# Altium project LED_Matrix.PrjPcb (part 3 of 3)

## Sheet LED.SchDoc
size A3; SheetNumber: 6; SheetTotal: 6
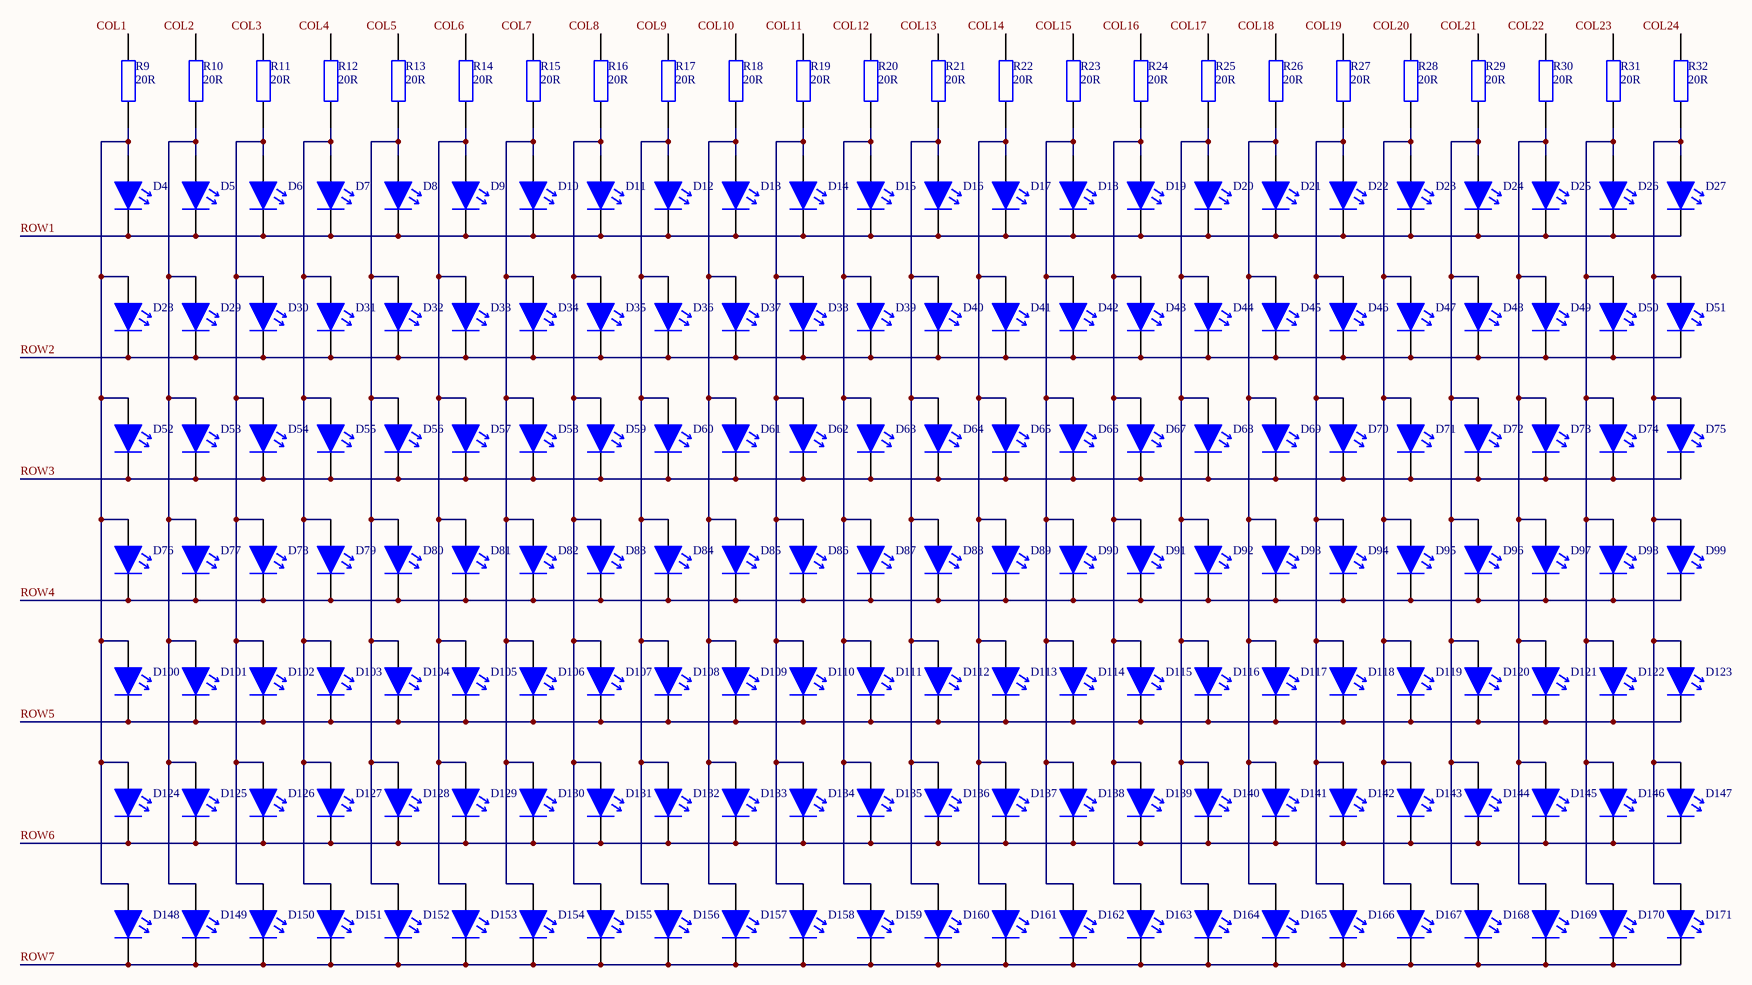
[diagram p5: LED.SchDoc]

### Parts
D4  EAHE2835WD63  [LED_WHITE_1411_PLCC2]  (value not drawn)
D5  EAHE2835WD63  [LED_WHITE_1411_PLCC2]  (value not drawn)
D6  EAHE2835WD63  [LED_WHITE_1411_PLCC2]  (value not drawn)
D7  EAHE2835WD63  [LED_WHITE_1411_PLCC2]  (value not drawn)
D8  EAHE2835WD63  [LED_WHITE_1411_PLCC2]  (value not drawn)
D9  EAHE2835WD63  [LED_WHITE_1411_PLCC2]  (value not drawn)
D10  EAHE2835WD63  [LED_WHITE_1411_PLCC2]  (value not drawn)
D11  EAHE2835WD63  [LED_WHITE_1411_PLCC2]  (value not drawn)
D12  EAHE2835WD63  [LED_WHITE_1411_PLCC2]  (value not drawn)
D13  EAHE2835WD63  [LED_WHITE_1411_PLCC2]  (value not drawn)
D14  EAHE2835WD63  [LED_WHITE_1411_PLCC2]  (value not drawn)
D15  EAHE2835WD63  [LED_WHITE_1411_PLCC2]  (value not drawn)
D16  EAHE2835WD63  [LED_WHITE_1411_PLCC2]  (value not drawn)
D17  EAHE2835WD63  [LED_WHITE_1411_PLCC2]  (value not drawn)
D18  EAHE2835WD63  [LED_WHITE_1411_PLCC2]  (value not drawn)
D19  EAHE2835WD63  [LED_WHITE_1411_PLCC2]  (value not drawn)
D20  EAHE2835WD63  [LED_WHITE_1411_PLCC2]  (value not drawn)
D21  EAHE2835WD63  [LED_WHITE_1411_PLCC2]  (value not drawn)
D22  EAHE2835WD63  [LED_WHITE_1411_PLCC2]  (value not drawn)
D23  EAHE2835WD63  [LED_WHITE_1411_PLCC2]  (value not drawn)
D24  EAHE2835WD63  [LED_WHITE_1411_PLCC2]  (value not drawn)
D25  EAHE2835WD63  [LED_WHITE_1411_PLCC2]  (value not drawn)
D26  EAHE2835WD63  [LED_WHITE_1411_PLCC2]  (value not drawn)
D27  EAHE2835WD63  [LED_WHITE_1411_PLCC2]  (value not drawn)
D28  EAHE2835WD63  [LED_WHITE_1411_PLCC2]  (value not drawn)
D29  EAHE2835WD63  [LED_WHITE_1411_PLCC2]  (value not drawn)
D30  EAHE2835WD63  [LED_WHITE_1411_PLCC2]  (value not drawn)
D31  EAHE2835WD63  [LED_WHITE_1411_PLCC2]  (value not drawn)
D32  EAHE2835WD63  [LED_WHITE_1411_PLCC2]  (value not drawn)
D33  EAHE2835WD63  [LED_WHITE_1411_PLCC2]  (value not drawn)
D34  EAHE2835WD63  [LED_WHITE_1411_PLCC2]  (value not drawn)
D35  EAHE2835WD63  [LED_WHITE_1411_PLCC2]  (value not drawn)
D36  EAHE2835WD63  [LED_WHITE_1411_PLCC2]  (value not drawn)
D37  EAHE2835WD63  [LED_WHITE_1411_PLCC2]  (value not drawn)
D38  EAHE2835WD63  [LED_WHITE_1411_PLCC2]  (value not drawn)
D39  EAHE2835WD63  [LED_WHITE_1411_PLCC2]  (value not drawn)
D40  EAHE2835WD63  [LED_WHITE_1411_PLCC2]  (value not drawn)
D41  EAHE2835WD63  [LED_WHITE_1411_PLCC2]  (value not drawn)
D42  EAHE2835WD63  [LED_WHITE_1411_PLCC2]  (value not drawn)
D43  EAHE2835WD63  [LED_WHITE_1411_PLCC2]  (value not drawn)
D44  EAHE2835WD63  [LED_WHITE_1411_PLCC2]  (value not drawn)
D45  EAHE2835WD63  [LED_WHITE_1411_PLCC2]  (value not drawn)
D46  EAHE2835WD63  [LED_WHITE_1411_PLCC2]  (value not drawn)
D47  EAHE2835WD63  [LED_WHITE_1411_PLCC2]  (value not drawn)
D48  EAHE2835WD63  [LED_WHITE_1411_PLCC2]  (value not drawn)
D49  EAHE2835WD63  [LED_WHITE_1411_PLCC2]  (value not drawn)
D50  EAHE2835WD63  [LED_WHITE_1411_PLCC2]  (value not drawn)
D51  EAHE2835WD63  [LED_WHITE_1411_PLCC2]  (value not drawn)
D52  EAHE2835WD63  [LED_WHITE_1411_PLCC2]  (value not drawn)
D53  EAHE2835WD63  [LED_WHITE_1411_PLCC2]  (value not drawn)
D54  EAHE2835WD63  [LED_WHITE_1411_PLCC2]  (value not drawn)
D55  EAHE2835WD63  [LED_WHITE_1411_PLCC2]  (value not drawn)
D56  EAHE2835WD63  [LED_WHITE_1411_PLCC2]  (value not drawn)
D57  EAHE2835WD63  [LED_WHITE_1411_PLCC2]  (value not drawn)
D58  EAHE2835WD63  [LED_WHITE_1411_PLCC2]  (value not drawn)
D59  EAHE2835WD63  [LED_WHITE_1411_PLCC2]  (value not drawn)
D60  EAHE2835WD63  [LED_WHITE_1411_PLCC2]  (value not drawn)
D61  EAHE2835WD63  [LED_WHITE_1411_PLCC2]  (value not drawn)
D62  EAHE2835WD63  [LED_WHITE_1411_PLCC2]  (value not drawn)
D63  EAHE2835WD63  [LED_WHITE_1411_PLCC2]  (value not drawn)
D64  EAHE2835WD63  [LED_WHITE_1411_PLCC2]  (value not drawn)
D65  EAHE2835WD63  [LED_WHITE_1411_PLCC2]  (value not drawn)
D66  EAHE2835WD63  [LED_WHITE_1411_PLCC2]  (value not drawn)
D67  EAHE2835WD63  [LED_WHITE_1411_PLCC2]  (value not drawn)
D68  EAHE2835WD63  [LED_WHITE_1411_PLCC2]  (value not drawn)
D69  EAHE2835WD63  [LED_WHITE_1411_PLCC2]  (value not drawn)
D70  EAHE2835WD63  [LED_WHITE_1411_PLCC2]  (value not drawn)
D71  EAHE2835WD63  [LED_WHITE_1411_PLCC2]  (value not drawn)
D72  EAHE2835WD63  [LED_WHITE_1411_PLCC2]  (value not drawn)
D73  EAHE2835WD63  [LED_WHITE_1411_PLCC2]  (value not drawn)
D74  EAHE2835WD63  [LED_WHITE_1411_PLCC2]  (value not drawn)
D75  EAHE2835WD63  [LED_WHITE_1411_PLCC2]  (value not drawn)
D76  EAHE2835WD63  [LED_WHITE_1411_PLCC2]  (value not drawn)
D77  EAHE2835WD63  [LED_WHITE_1411_PLCC2]  (value not drawn)
D78  EAHE2835WD63  [LED_WHITE_1411_PLCC2]  (value not drawn)
D79  EAHE2835WD63  [LED_WHITE_1411_PLCC2]  (value not drawn)
D80  EAHE2835WD63  [LED_WHITE_1411_PLCC2]  (value not drawn)
D81  EAHE2835WD63  [LED_WHITE_1411_PLCC2]  (value not drawn)
D82  EAHE2835WD63  [LED_WHITE_1411_PLCC2]  (value not drawn)
D83  EAHE2835WD63  [LED_WHITE_1411_PLCC2]  (value not drawn)
D84  EAHE2835WD63  [LED_WHITE_1411_PLCC2]  (value not drawn)
D85  EAHE2835WD63  [LED_WHITE_1411_PLCC2]  (value not drawn)
D86  EAHE2835WD63  [LED_WHITE_1411_PLCC2]  (value not drawn)
D87  EAHE2835WD63  [LED_WHITE_1411_PLCC2]  (value not drawn)
D88  EAHE2835WD63  [LED_WHITE_1411_PLCC2]  (value not drawn)
D89  EAHE2835WD63  [LED_WHITE_1411_PLCC2]  (value not drawn)
D90  EAHE2835WD63  [LED_WHITE_1411_PLCC2]  (value not drawn)
D91  EAHE2835WD63  [LED_WHITE_1411_PLCC2]  (value not drawn)
D92  EAHE2835WD63  [LED_WHITE_1411_PLCC2]  (value not drawn)
D93  EAHE2835WD63  [LED_WHITE_1411_PLCC2]  (value not drawn)
D94  EAHE2835WD63  [LED_WHITE_1411_PLCC2]  (value not drawn)
D95  EAHE2835WD63  [LED_WHITE_1411_PLCC2]  (value not drawn)
D96  EAHE2835WD63  [LED_WHITE_1411_PLCC2]  (value not drawn)
D97  EAHE2835WD63  [LED_WHITE_1411_PLCC2]  (value not drawn)
D98  EAHE2835WD63  [LED_WHITE_1411_PLCC2]  (value not drawn)
D99  EAHE2835WD63  [LED_WHITE_1411_PLCC2]  (value not drawn)
D100  EAHE2835WD63  [LED_WHITE_1411_PLCC2]  (value not drawn)
D101  EAHE2835WD63  [LED_WHITE_1411_PLCC2]  (value not drawn)
D102  EAHE2835WD63  [LED_WHITE_1411_PLCC2]  (value not drawn)
D103  EAHE2835WD63  [LED_WHITE_1411_PLCC2]  (value not drawn)
D104  EAHE2835WD63  [LED_WHITE_1411_PLCC2]  (value not drawn)
D105  EAHE2835WD63  [LED_WHITE_1411_PLCC2]  (value not drawn)
D106  EAHE2835WD63  [LED_WHITE_1411_PLCC2]  (value not drawn)
D107  EAHE2835WD63  [LED_WHITE_1411_PLCC2]  (value not drawn)
D108  EAHE2835WD63  [LED_WHITE_1411_PLCC2]  (value not drawn)
D109  EAHE2835WD63  [LED_WHITE_1411_PLCC2]  (value not drawn)
D110  EAHE2835WD63  [LED_WHITE_1411_PLCC2]  (value not drawn)
D111  EAHE2835WD63  [LED_WHITE_1411_PLCC2]  (value not drawn)
D112  EAHE2835WD63  [LED_WHITE_1411_PLCC2]  (value not drawn)
D113  EAHE2835WD63  [LED_WHITE_1411_PLCC2]  (value not drawn)
D114  EAHE2835WD63  [LED_WHITE_1411_PLCC2]  (value not drawn)
D115  EAHE2835WD63  [LED_WHITE_1411_PLCC2]  (value not drawn)
D116  EAHE2835WD63  [LED_WHITE_1411_PLCC2]  (value not drawn)
D117  EAHE2835WD63  [LED_WHITE_1411_PLCC2]  (value not drawn)
D118  EAHE2835WD63  [LED_WHITE_1411_PLCC2]  (value not drawn)
D119  EAHE2835WD63  [LED_WHITE_1411_PLCC2]  (value not drawn)
D120  EAHE2835WD63  [LED_WHITE_1411_PLCC2]  (value not drawn)
D121  EAHE2835WD63  [LED_WHITE_1411_PLCC2]  (value not drawn)
D122  EAHE2835WD63  [LED_WHITE_1411_PLCC2]  (value not drawn)
D123  EAHE2835WD63  [LED_WHITE_1411_PLCC2]  (value not drawn)
D124  EAHE2835WD63  [LED_WHITE_1411_PLCC2]  (value not drawn)
D125  EAHE2835WD63  [LED_WHITE_1411_PLCC2]  (value not drawn)
D126  EAHE2835WD63  [LED_WHITE_1411_PLCC2]  (value not drawn)
D127  EAHE2835WD63  [LED_WHITE_1411_PLCC2]  (value not drawn)
D128  EAHE2835WD63  [LED_WHITE_1411_PLCC2]  (value not drawn)
D129  EAHE2835WD63  [LED_WHITE_1411_PLCC2]  (value not drawn)
D130  EAHE2835WD63  [LED_WHITE_1411_PLCC2]  (value not drawn)
D131  EAHE2835WD63  [LED_WHITE_1411_PLCC2]  (value not drawn)
D132  EAHE2835WD63  [LED_WHITE_1411_PLCC2]  (value not drawn)
D133  EAHE2835WD63  [LED_WHITE_1411_PLCC2]  (value not drawn)
D134  EAHE2835WD63  [LED_WHITE_1411_PLCC2]  (value not drawn)
D135  EAHE2835WD63  [LED_WHITE_1411_PLCC2]  (value not drawn)
D136  EAHE2835WD63  [LED_WHITE_1411_PLCC2]  (value not drawn)
D137  EAHE2835WD63  [LED_WHITE_1411_PLCC2]  (value not drawn)
D138  EAHE2835WD63  [LED_WHITE_1411_PLCC2]  (value not drawn)
D139  EAHE2835WD63  [LED_WHITE_1411_PLCC2]  (value not drawn)
D140  EAHE2835WD63  [LED_WHITE_1411_PLCC2]  (value not drawn)
D141  EAHE2835WD63  [LED_WHITE_1411_PLCC2]  (value not drawn)
D142  EAHE2835WD63  [LED_WHITE_1411_PLCC2]  (value not drawn)
D143  EAHE2835WD63  [LED_WHITE_1411_PLCC2]  (value not drawn)
D144  EAHE2835WD63  [LED_WHITE_1411_PLCC2]  (value not drawn)
D145  EAHE2835WD63  [LED_WHITE_1411_PLCC2]  (value not drawn)
D146  EAHE2835WD63  [LED_WHITE_1411_PLCC2]  (value not drawn)
D147  EAHE2835WD63  [LED_WHITE_1411_PLCC2]  (value not drawn)
D148  EAHE2835WD63  [LED_WHITE_1411_PLCC2]  (value not drawn)
D149  EAHE2835WD63  [LED_WHITE_1411_PLCC2]  (value not drawn)
D150  EAHE2835WD63  [LED_WHITE_1411_PLCC2]  (value not drawn)
D151  EAHE2835WD63  [LED_WHITE_1411_PLCC2]  (value not drawn)
D152  EAHE2835WD63  [LED_WHITE_1411_PLCC2]  (value not drawn)
D153  EAHE2835WD63  [LED_WHITE_1411_PLCC2]  (value not drawn)
D154  EAHE2835WD63  [LED_WHITE_1411_PLCC2]  (value not drawn)
D155  EAHE2835WD63  [LED_WHITE_1411_PLCC2]  (value not drawn)
D156  EAHE2835WD63  [LED_WHITE_1411_PLCC2]  (value not drawn)
D157  EAHE2835WD63  [LED_WHITE_1411_PLCC2]  (value not drawn)
D158  EAHE2835WD63  [LED_WHITE_1411_PLCC2]  (value not drawn)
D159  EAHE2835WD63  [LED_WHITE_1411_PLCC2]  (value not drawn)
D160  EAHE2835WD63  [LED_WHITE_1411_PLCC2]  (value not drawn)
D161  EAHE2835WD63  [LED_WHITE_1411_PLCC2]  (value not drawn)
D162  EAHE2835WD63  [LED_WHITE_1411_PLCC2]  (value not drawn)
D163  EAHE2835WD63  [LED_WHITE_1411_PLCC2]  (value not drawn)
D164  EAHE2835WD63  [LED_WHITE_1411_PLCC2]  (value not drawn)
D165  EAHE2835WD63  [LED_WHITE_1411_PLCC2]  (value not drawn)
D166  EAHE2835WD63  [LED_WHITE_1411_PLCC2]  (value not drawn)
D167  EAHE2835WD63  [LED_WHITE_1411_PLCC2]  (value not drawn)
D168  EAHE2835WD63  [LED_WHITE_1411_PLCC2]  (value not drawn)
D169  EAHE2835WD63  [LED_WHITE_1411_PLCC2]  (value not drawn)
D170  EAHE2835WD63  [LED_WHITE_1411_PLCC2]  (value not drawn)
D171  EAHE2835WD63  [LED_WHITE_1411_PLCC2]  (value not drawn)
R9  Resistance: 20R  [RES_1206]  (hidden comment: HRG3216Q-20R0-D-T1)
R10  Resistance: 20R  [RES_1206]  (hidden comment: HRG3216Q-20R0-D-T1)
R11  Resistance: 20R  [RES_1206]  (hidden comment: HRG3216Q-20R0-D-T1)
R12  Resistance: 20R  [RES_1206]  (hidden comment: HRG3216Q-20R0-D-T1)
R13  Resistance: 20R  [RES_1206]  (hidden comment: HRG3216Q-20R0-D-T1)
R14  Resistance: 20R  [RES_1206]  (hidden comment: HRG3216Q-20R0-D-T1)
R15  Resistance: 20R  [RES_1206]  (hidden comment: HRG3216Q-20R0-D-T1)
R16  Resistance: 20R  [RES_1206]  (hidden comment: HRG3216Q-20R0-D-T1)
R17  Resistance: 20R  [RES_1206]  (hidden comment: HRG3216Q-20R0-D-T1)
R18  Resistance: 20R  [RES_1206]  (hidden comment: HRG3216Q-20R0-D-T1)
R19  Resistance: 20R  [RES_1206]  (hidden comment: HRG3216Q-20R0-D-T1)
R20  Resistance: 20R  [RES_1206]  (hidden comment: HRG3216Q-20R0-D-T1)
R21  Resistance: 20R  [RES_1206]  (hidden comment: HRG3216Q-20R0-D-T1)
R22  Resistance: 20R  [RES_1206]  (hidden comment: HRG3216Q-20R0-D-T1)
R23  Resistance: 20R  [RES_1206]  (hidden comment: HRG3216Q-20R0-D-T1)
R24  Resistance: 20R  [RES_1206]  (hidden comment: HRG3216Q-20R0-D-T1)
R25  Resistance: 20R  [RES_1206]  (hidden comment: HRG3216Q-20R0-D-T1)
R26  Resistance: 20R  [RES_1206]  (hidden comment: HRG3216Q-20R0-D-T1)
R27  Resistance: 20R  [RES_1206]  (hidden comment: HRG3216Q-20R0-D-T1)
R28  Resistance: 20R  [RES_1206]  (hidden comment: HRG3216Q-20R0-D-T1)
R29  Resistance: 20R  [RES_1206]  (hidden comment: HRG3216Q-20R0-D-T1)
R30  Resistance: 20R  [RES_1206]  (hidden comment: HRG3216Q-20R0-D-T1)
R31  Resistance: 20R  [RES_1206]  (hidden comment: HRG3216Q-20R0-D-T1)
R32  Resistance: 20R  [RES_1206]  (hidden comment: HRG3216Q-20R0-D-T1)

### Nets
COL1: R9.2
COL2: R10.2
COL3: R11.2
COL4: R12.2
COL5: R13.2
COL6: R14.2
COL7: R15.2
COL8: R16.2
COL9: R17.2
COL10: R18.2
COL11: R19.2
COL12: R20.2
COL13: R21.2
COL14: R22.2
COL15: R23.2
COL16: R24.2
COL17: R25.2
COL18: R26.2
COL19: R27.2
COL20: R28.2
COL21: R29.2
COL22: R30.2
COL23: R31.2
COL24: R32.2
ROW1: D4.2 D5.2 D6.2 D7.2 D8.2 D9.2 D10.2 D11.2 D12.2 D13.2 D14.2 D15.2 D16.2 D17.2 D18.2 D19.2 D20.2 D21.2 D22.2 D23.2 D24.2 D25.2 D26.2 D27.2
ROW2: D28.2 D29.2 D30.2 D31.2 D32.2 D33.2 D34.2 D35.2 D36.2 D37.2 D38.2 D39.2 D40.2 D41.2 D42.2 D43.2 D44.2 D45.2 D46.2 D47.2 D48.2 D49.2 D50.2 D51.2
ROW3: D52.2 D53.2 D54.2 D55.2 D56.2 D57.2 D58.2 D59.2 D60.2 D61.2 D62.2 D63.2 D64.2 D65.2 D66.2 D67.2 D68.2 D69.2 D70.2 D71.2 D72.2 D73.2 D74.2 D75.2
ROW4: D76.2 D77.2 D78.2 D79.2 D80.2 D81.2 D82.2 D83.2 D84.2 D85.2 D86.2 D87.2 D88.2 D89.2 D90.2 D91.2 D92.2 D93.2 D94.2 D95.2 D96.2 D97.2 D98.2 D99.2
ROW5: D100.2 D101.2 D102.2 D103.2 D104.2 D105.2 D106.2 D107.2 D108.2 D109.2 D110.2 D111.2 D112.2 D113.2 D114.2 D115.2 D116.2 D117.2 D118.2 D119.2 D120.2 D121.2 D122.2 D123.2
ROW6: D124.2 D125.2 D126.2 D127.2 D128.2 D129.2 D130.2 D131.2 D132.2 D133.2 D134.2 D135.2 D136.2 D137.2 D138.2 D139.2 D140.2 D141.2 D142.2 D143.2 D144.2 D145.2 D146.2 D147.2
ROW7: D148.2 D149.2 D150.2 D151.2 D152.2 D153.2 D154.2 D155.2 D156.2 D157.2 D158.2 D159.2 D160.2 D161.2 D162.2 D163.2 D164.2 D165.2 D166.2 D167.2 D168.2 D169.2 D170.2 D171.2
NetD4_1: D4.1 D28.1 D52.1 D76.1 D100.1 D124.1 D148.1 R9.1
NetD5_1: D5.1 D29.1 D53.1 D77.1 D101.1 D125.1 D149.1 R10.1
NetD6_1: D6.1 D30.1 D54.1 D78.1 D102.1 D126.1 D150.1 R11.1
NetD7_1: D7.1 D31.1 D55.1 D79.1 D103.1 D127.1 D151.1 R12.1
NetD8_1: D8.1 D32.1 D56.1 D80.1 D104.1 D128.1 D152.1 R13.1
NetD9_1: D9.1 D33.1 D57.1 D81.1 D105.1 D129.1 D153.1 R14.1
NetD10_1: D10.1 D34.1 D58.1 D82.1 D106.1 D130.1 D154.1 R15.1
NetD11_1: D11.1 D35.1 D59.1 D83.1 D107.1 D131.1 D155.1 R16.1
NetD12_1: D12.1 D36.1 D60.1 D84.1 D108.1 D132.1 D156.1 R17.1
NetD13_1: D13.1 D37.1 D61.1 D85.1 D109.1 D133.1 D157.1 R18.1
NetD14_1: D14.1 D38.1 D62.1 D86.1 D110.1 D134.1 D158.1 R19.1
NetD15_1: D15.1 D39.1 D63.1 D87.1 D111.1 D135.1 D159.1 R20.1
NetD16_1: D16.1 D40.1 D64.1 D88.1 D112.1 D136.1 D160.1 R21.1
NetD17_1: D17.1 D41.1 D65.1 D89.1 D113.1 D137.1 D161.1 R22.1
NetD18_1: D18.1 D42.1 D66.1 D90.1 D114.1 D138.1 D162.1 R23.1
NetD19_1: D19.1 D43.1 D67.1 D91.1 D115.1 D139.1 D163.1 R24.1
NetD20_1: D20.1 D44.1 D68.1 D92.1 D116.1 D140.1 D164.1 R25.1
NetD21_1: D21.1 D45.1 D69.1 D93.1 D117.1 D141.1 D165.1 R26.1
NetD22_1: D22.1 D46.1 D70.1 D94.1 D118.1 D142.1 D166.1 R27.1
NetD23_1: D23.1 D47.1 D71.1 D95.1 D119.1 D143.1 D167.1 R28.1
NetD24_1: D24.1 D48.1 D72.1 D96.1 D120.1 D144.1 D168.1 R29.1
NetD25_1: D25.1 D49.1 D73.1 D97.1 D121.1 D145.1 D169.1 R30.1
NetD26_1: D26.1 D50.1 D74.1 D98.1 D122.1 D146.1 D170.1 R31.1
NetD27_1: D27.1 D51.1 D75.1 D99.1 D123.1 D147.1 D171.1 R32.1

### Notes on the sheet
- DOSYA ADI / FILE NAME
- TANIM / DESCRIPTION
- HAZIRLAYAN / PREPARED BY
- YAYIN TARİHİ / REL. DATE
- BOYUT / SIZE
- SAYFA / SHEET
- /

### Library data of the parts
D4-D171 = LED COOL WHITE 6500K 2PLCC 1411: LED Uni-Color White 39lm 6500K Chip LED 2-Pin PLCC T/R; Manufacturer: Everlight; Test Current: 65mA; Color Rendering Index (CRI): 80; Max Current Rating: 180mA; Viewing Angle: 120°; Thermal Resistance of Package: 30°C/W; Forward Voltage: 2.85V; DesignedBy: Aslı Kurt; Supplier 1: Digikey; Manufacturer Part Number: EAHE2835WD63; RoHS: Yes; Stock 1: 15575; Pricing 1: 1=0,33, 10=0,26, 100=0,1168, 500=0,10552, 1000=0,08667, 2000=0,07537 (USD); Mount: Surface Mount; Case/Package: 1411; Case Code (Imperial): 1411; Case Code (Metric): 3528; Packaging: Cut Tape; Correlated Color Temperature (CCT): 6500K; Series: -; RoHS Compliant: Yes; ComponentLink1URL: http://www.mouser.com/ds/2/143/EAHE2835WD63-933543.pdf?src-supplier=Mouser; ComponentLink1Description: http://www.mouser.com/ds/2/143/EAHE2835WD63-933543.pdf?src-supplier=Mouser; ComponentLink2URL: https://everlightamericas.com/index.php?controller=attachment&id_attachment=2294&src-supplier=Digikey; ComponentLink2Description: https://everlightamericas.com/index.php?controller=attachment&id_attachment=2294&src-supplier=Digikey; Supplier 2: Digikey; Stock 2: 15575; Pricing 2: 1=0,33, 10=0,26, 100=0,1168, 500=0,10552, 1000=0,08667, 2000=0,07537 (USD); Supplier 3: Digikey; Stock 3: 12000; Pricing 3: 4000=0,07537, 8000=0,06783, 12000=0,06029, 28000=0,05652, 100000=0,04899 (USD); Supplier Part Number 3: 1080-1456-2-ND; Supplier Part Number 2: 1080-1456-6-ND; Supplier Part Number 1: 1080-1456-1-ND; Color: White
R9-R32 = RES 20 OHM 1206 1W: Fixed Resistor, Thin Film, 1W, 20ohm, 200V, 0.5% +/-Tol, 50ppm/Cel, Surface Mount, 1206; Manufacturer: Susumu; DesignedBy: Aslı Kurt; Supplier 1: Farnell; Manufacturer Part Number: HRG3216Q-20R0-D-T1; RoHS: Yes; Category: Chip SMD Resistors; Stock 1: 809; Pricing 1: 1=0,906, 10=0,65, 25=0,598, 50=0,546, 100=0,494 (EUR); Voltage Rating (DC): 200V; ComponentLink1URL: https://datasheet.octopart.com/HRG3216Q-20R0-D-T1-Susumu-datasheet-117013349.pdf?src-supplier=Future+Electronics; ComponentLink1Description: https://datasheet.octopart.com/HRG3216Q-20R0-D-T1-Susumu-datasheet-117013349.pdf?src-supplier=Future+Electronics; ComponentLink2URL: http://www.susumu.co.jp/common/pdf/n_catalog_partition24_en.pdf?src-supplier=Digikey; ComponentLink2Description: http://www.susumu.co.jp/common/pdf/n_catalog_partition24_en.pdf?src-supplier=Digikey; Supplier 2: Mouser; Stock 2: 7886; Pricing 2: 1=0,89, 10=0,63, 50=0,479, 100=0,423, 1000=0,285, 10000=0,279 (USD); Supplier 3: Newark; Stock 3: 821; Pricing 3: 1=0,926, 10=0,655, 25=0,628, 50=0,498, 100=0,44 (USD); Supplier 4: Digikey; Stock 4: 16967; Pricing 4: 1=0,88, 10=0,62, 50=0,4766, 100=0,423, 500=0,31442 (USD); Supplier 5: Digikey; Stock 5: 16967; Pricing 5: 1=0,88, 10=0,62, 50=0,4766, 100=0,423, 500=0,31442 (USD); Supplier Part Number 5: 408-1893-6-ND; Supplier Part Number 4: 408-1893-1-ND; Supplier Part Number 3: 70AC1143; Supplier Part Number 2: 754-HRG3216Q20R0DT1; Supplier Part Number 1: 2920358

## Nets that join several sheets
3V3: PowerManagement (8 pins), MCU (C12.2 D2.1 R1.2 U3.4), EnvironmentalElements (5 pins)
3V3_ESP: PowerManagement (SW2.1), EnvironmentalElements (6 pins)
5V: PowerManagement (5 pins), MCU (BUZ1.P C14.1 D3.1 U4.9), EnvironmentalElements (9 pins)
GND: PowerManagement (17 pins), MCU (8 pins), EnvironmentalElements (20 pins)
COL1: EnvironmentalElements (U5.15), LED (R9.2)
COL2: EnvironmentalElements (U5.1), LED (R10.2)
COL3: EnvironmentalElements (U5.2), LED (R11.2)
COL4: EnvironmentalElements (U5.3), LED (R12.2)
COL5: EnvironmentalElements (U5.4), LED (R13.2)
COL6: EnvironmentalElements (U5.5), LED (R14.2)
COL7: EnvironmentalElements (U5.6), LED (R15.2)
COL8: EnvironmentalElements (U5.7), LED (R16.2)
COL9: EnvironmentalElements (U7.15), LED (R17.2)
COL10: EnvironmentalElements (U7.1), LED (R18.2)
COL11: EnvironmentalElements (U7.2), LED (R19.2)
COL12: EnvironmentalElements (U7.3), LED (R20.2)
COL13: EnvironmentalElements (U7.4), LED (R21.2)
COL14: EnvironmentalElements (U7.5), LED (R22.2)
COL15: EnvironmentalElements (U7.6), LED (R23.2)
COL16: EnvironmentalElements (U7.7), LED (R24.2)
COL17: EnvironmentalElements (U8.15), LED (R25.2)
COL18: EnvironmentalElements (U8.1), LED (R26.2)
COL19: EnvironmentalElements (U8.2), LED (R27.2)
COL20: EnvironmentalElements (U8.3), LED (R28.2)
COL21: EnvironmentalElements (U8.4), LED (R29.2)
COL22: EnvironmentalElements (U8.5), LED (R30.2)
COL23: EnvironmentalElements (U8.6), LED (R31.2)
COL24: EnvironmentalElements (U8.7), LED (R32.2)
MCU_RX: MCU (U3.10), EnvironmentalElements (U9.35)
MCU_SCL: MCU (U3.1), EnvironmentalElements (R7.1 U6.1)
MCU_SDA: MCU (U3.2), EnvironmentalElements (R6.1 U6.6)
MCU_TX: MCU (U3.9), EnvironmentalElements (U9.34)
NRST: PowerManagement (J3.5), MCU (SW3.1 U3.6)
ROW1: MCU (U4.16), LED (24 pins)
ROW2: MCU (U4.15), LED (24 pins)
ROW3: MCU (U4.14), LED (24 pins)
ROW4: MCU (U4.13), LED (24 pins)
ROW5: MCU (U4.12), LED (24 pins)
ROW6: MCU (U4.11), LED (24 pins)
ROW7: MCU (U4.10), LED (24 pins)
SH_CLK: MCU (U3.7), EnvironmentalElements (U5.11 U7.11 U8.11)
SH_DIN: MCU (U3.20), EnvironmentalElements (U5.14)
SH_LATCH: MCU (U3.8), EnvironmentalElements (U5.12 U7.12 U8.12)
SWCLK: PowerManagement (J3.2), MCU (U3.19)
SWDIO: PowerManagement (J3.4), MCU (U3.18)